# Altium schematic sheet main.SchDoc: OpenSDA
size 431 x 279 mm; Author: Author; CompanyName: Phyzika Technologies, Inc.; Engineer: SanB; Organization: Phyzika Technologies; Address1: 11855 SW Ridgecrest Dr; Address2: Suite 127; Address3: Beaverton, OR 97008; Address4: 503-646-3333; SheetNumber: 1; SheetTotal: 1; SheetSize: 11x17
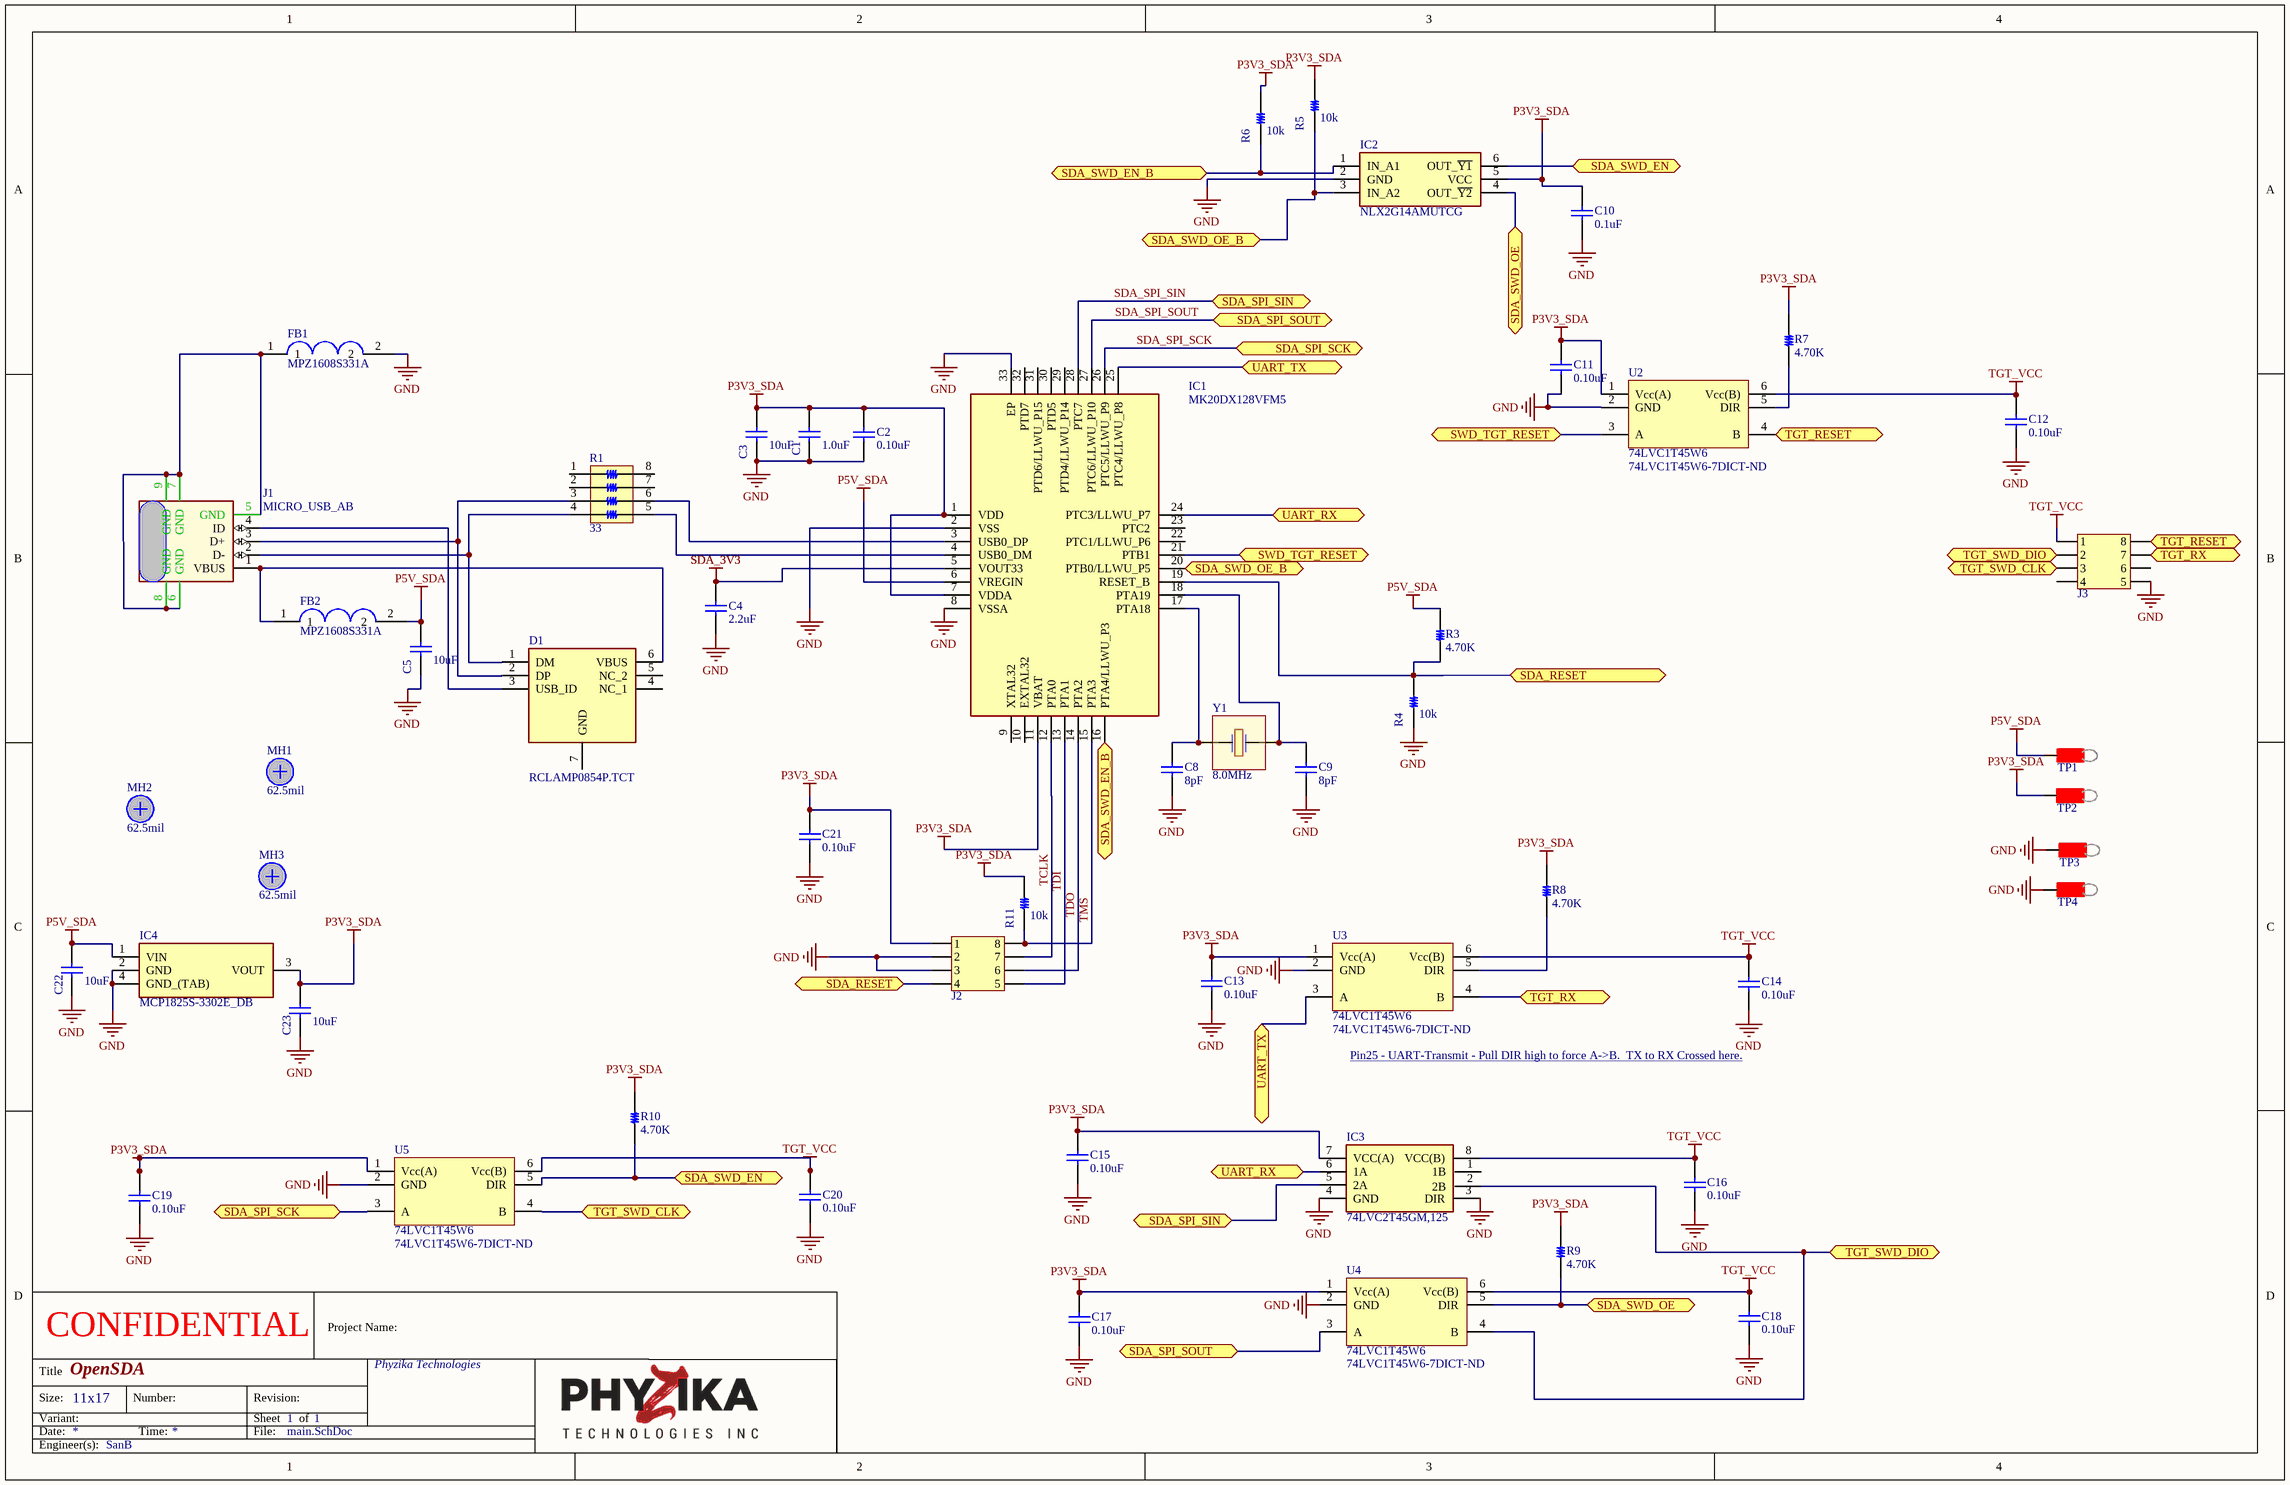
[diagram p0: main.SchDoc]

## Parts
C1  value 1.0uF  [C1005L]  (hidden comment: C105-0402-X5R-16V0-20%)
C2  value 0.10uF  [C1005N]  (hidden comment: C104_0402_X7R_16V0_10%_Kemet)
C3  value 10uF  [C1608N]  (hidden comment: C106-0603-X5R-6.3V_+/-20%_Taiyo Yuden)
C4  2.2uF  [C1005L]
C5  value 10uF  [C1608N]  (hidden comment: C106-0603-X5R-6.3V_+/-20%_Taiyo Yuden)
C8  8pF  [C1005L]
C9  8pF  [C1005L]
C10  value 0.1uF  [C1005L]  (hidden comment: C104_0402_X7R_25V0_10%_Murata)
C11  value 0.10uF  [C1005L]  (hidden comment: C104-0402-X7R-16V0-10%)
C12  value 0.10uF  [C1005L]  (hidden comment: C104-0402-X7R-16V0-10%)
C13  value 0.10uF  [C1005L]  (hidden comment: C104-0402-X7R-16V0-10%)
C14  value 0.10uF  [C1005L]  (hidden comment: C104-0402-X7R-16V0-10%)
C15  value 0.10uF  [C1005L]  (hidden comment: C104-0402-X7R-16V0-10%)
C16  value 0.10uF  [C1005L]  (hidden comment: C104-0402-X7R-16V0-10%)
C17  value 0.10uF  [C1005L]  (hidden comment: C104-0402-X7R-16V0-10%)
C18  value 0.10uF  [C1005L]  (hidden comment: C104-0402-X7R-16V0-10%)
C19  value 0.10uF  [C1005L]  (hidden comment: C104-0402-X7R-16V0-10%)
C20  value 0.10uF  [C1005L]  (hidden comment: C104-0402-X7R-16V0-10%)
C21  value 0.10uF  [C1005N]  (hidden comment: C104_0402_X7R_16V0_10%_Kemet)
C22  value 10uF  [C1608N]  (hidden comment: C106-0603-X5R-6.3V_+/-20%_Taiyo Yuden)
C23  value 10uF  [C1608N]  (hidden comment: C106-0603-X5R-6.3V_+/-20%_Taiyo Yuden)
D1  RCLAMP0854P.TCT  [SON50P160X160X65-7N]
FB1  MPZ1608S331A  [BEADC1608X95N]
FB2  MPZ1608S331A  [BEADC1608X95N]
IC1  MK20DX128VFM5  [QFN50P500X500X100-33N-D]
IC2  NLX2G14AMUTCG  [SON50P100X145X55-6N]
IC3  74LVC2T45GM,125  [74AUP2G08GM125]
IC4  MCP1825S-3302E_DB  [SOT230P700X180-4N]
J1  MICRO_USB_AB  [CONN USB_MIcro_AB]
J2  HEADER 4x2 50mil FCI  [4x2 50mil header_FCI]  (value not drawn)
J3  HEADER 4x2 50mil FCI  [4x2 50mil header_FCI]  (value not drawn)
MH1  62.5mil  [MTHOLE62.5mil]  (no BOM)
MH2  62.5mil  [MTHOLE62.5mil]  (no BOM)
MH3  62.5mil  [MTHOLE62.5mil]  (no BOM)
R1  value 33  [CAC-50P200X100-8N]  (hidden comment: R330_ARRAY_X4_0804_5%_Pan)
R3  value 4.70K  [C1005M]  (hidden comment: R472-0402-1%)
R4  value 10k  [C1005N]  (hidden comment: R103-0402-5%_Yageo)
R5  value 10k  [C1005N]  (hidden comment: R103-0402-5%_Yageo)
R6  value 10k  [C1005N]  (hidden comment: R103-0402-5%_Yageo)
R7  value 4.70K  [C1005M]  (hidden comment: R472-0402-1%)
R8  value 4.70K  [C1005M]  (hidden comment: R472-0402-1%)
R9  value 4.70K  [C1005M]  (hidden comment: R472-0402-1%)
R10  value 4.70K  [C1005M]  (hidden comment: R472-0402-1%)
R11  value 10k  [C1005N]  (hidden comment: R103-0402-5%_Yageo)
TP1  TH_TP_67mil_RED  [TH_TP_67MIL_RED]  (value not drawn)
TP2  TH_TP_67mil_RED  [TH_TP_67MIL_RED]  (value not drawn)
TP3  TH_TP_67mil_RED  [TH_TP_67MIL_RED]  (value not drawn)
TP4  TH_TP_67mil_RED  [TH_TP_67MIL_RED]  (value not drawn)
U2  74LVC1T45W6  Supplier Part Number 1: 74LVC1T45W6-7DICT-ND  [SOT23-6_SOT95P280X145-6N]
U3  74LVC1T45W6  Supplier Part Number 1: 74LVC1T45W6-7DICT-ND  [SOT23-6_SOT95P280X145-6N]
U4  74LVC1T45W6  Supplier Part Number 1: 74LVC1T45W6-7DICT-ND  [SOT23-6_SOT95P280X145-6N]
U5  74LVC1T45W6  Supplier Part Number 1: 74LVC1T45W6-7DICT-ND  [SOT23-6_SOT95P280X145-6N]
Y1  8.0MHz  [XTAL_2-SMD_TXC]

## Ports
SDA_RESET (bidir), SDA_SPI_SCK (bidir), SDA_SPI_SIN (bidir), SDA_SPI_SOUT (bidir), SDA_SWD_EN (bidir), SDA_SWD_EN_B (bidir), SDA_SWD_OE (bidir), SDA_SWD_OE_B (bidir), SWD_TGT_RESET (bidir), TGT_RESET (bidir), TGT_RX (bidir), TGT_SWD_CLK (bidir), TGT_SWD_DIO (bidir), UART_RX (bidir), UART_TX (bidir)

## Nets
GND: C1.1 C2.1 C3.1 C4.1 C5.1 C8.1 C9.1 C10.1 C11.1 C12.1 C13.1 C14.1 C15.1 C16.1 C17.1 C18.1 C19.1 C20.1 C21.1 C22.1 C23.1 FB1.2 IC1.2(VSS) IC1.8(VSSA) IC1.33(EP) IC2.2(GND) IC3.3(DIR) IC3.4(GND) IC4.2(GND) IC4.4(GND_(TAB)) J2.2 J2.3 J3.5 R4.1 TP3.1 TP4.1 U2.2(GND) U3.2(GND) U4.2(GND) U5.2(GND)
P3V3_SDA: C1.2 C2.2 C3.2 C10.2 C11.2 C13.2 C15.2 C17.2 C19.2 C21.2 C23.2 IC1.1(VDD) IC1.7(VDDA) IC1.11(VBAT) IC2.5(VCC) IC3.7(VCC(A)) IC4.3(VOUT) J2.1 R5.2 R6.2 R7.2 R8.2 R9.2 R10.2 R11.2 TP2.1 U2.1(Vcc(A)) U3.1(Vcc(A)) U4.1(Vcc(A)) U5.1(Vcc(A))
P5V_SDA: C5.2 C22.2 FB2.2 IC1.6(VREGIN) IC4.1(VIN) R3.2 TP1.1
TGT_VCC: C12.2 C14.2 C16.2 C18.2 C20.2 IC3.8(VCC(B)) J3.1 U2.6(Vcc(B)) U3.6(Vcc(B)) U4.6(Vcc(B)) U5.6(Vcc(B))
SDA_RESET: IC1.19(RESET_B) J2.4 R3.1 R4.2 ; port SDA_RESET
SDA_SPI_SCK: IC1.26(PTC5/LLWU_P9) U5.3(A) ; port SDA_SPI_SCK
SDA_SPI_SIN: IC1.28(PTC7) IC3.5(2A) ; port SDA_SPI_SIN
SDA_SPI_SOUT: IC1.27(PTC6/LLWU_P10) U4.3(A) ; port SDA_SPI_SOUT
SDA_SWD_EN: IC2.6(OUT_~{Y1}) R10.1 U5.5(DIR) ; port SDA_SWD_EN
SDA_SWD_EN_B: IC1.16(PTA4/LLWU_P3) IC2.1(IN_A1) R6.1 ; port SDA_SWD_EN_B
SDA_SWD_OE: IC2.4(OUT_~{Y2}) R9.1 U4.5(DIR) ; port SDA_SWD_OE
SDA_SWD_OE_B: IC1.20(PTB0/LLWU_P5) IC2.3(IN_A2) R5.1 ; port SDA_SWD_OE_B
SWD_TGT_RESET: IC1.21(PTB1) U2.3(A) ; port SWD_TGT_RESET
TCLK: IC1.12(PTA0) J2.7
TDI: IC1.13(PTA1) J2.5
TDO: IC1.14(PTA2) J2.6
TGT_RESET: J3.8 U2.4(B) ; port TGT_RESET
TGT_RX: J3.7 U3.4(B) ; port TGT_RX
TGT_SWD_CLK: J3.3 U5.4(B) ; port TGT_SWD_CLK
TGT_SWD_DIO: IC3.2(2B) J3.2 U4.4(B) ; port TGT_SWD_DIO
TMS: IC1.15(PTA3) J2.8 R11.1
UART_RX: IC1.24(PTC3/LLWU_P7) IC3.6(1A) ; port UART_RX
UART_TX: IC1.25(PTC4/LLWU_P8) U3.3(A) ; port UART_TX
NetC4_2: C4.2 IC1.5(VOUT33)
NetC8_2: C8.2 IC1.17(PTA18) Y1.1(OSC1)
NetC9_2: C9.2 IC1.18(PTA19) Y1.2(OSC2)
NetD1_1: D1.1(DM) J1.2(D-) R1.4
NetD1_2: D1.2(DP) J1.3(D+) R1.3
NetD1_3: D1.3(USB_ID) J1.4(ID)
NetD1_6: D1.6(VBUS) FB2.1 J1.1(VBUS)
NetFB1_1: FB1.1 J1.5(GND) J1.6(GND) J1.7(GND) J1.8(GND) J1.9(GND)
NetIC1_3: IC1.3(USB0_DP) R1.6
NetIC1_4: IC1.4(USB0_DM) R1.5
NetR7_1: R7.1 U2.5(DIR)
NetR8_1: R8.1 U3.5(DIR)

Not connected (* = marked no-connect by the designer): D1 4(NC_1) 5(NC_2) 7(GND); IC1 9(XTAL32) 10(EXTAL32) 22(PTC1/LLWU_P6) 23(PTC2) 29(PTD4/LLWU_P14) 30(PTD5) 31(PTD6/LLWU_P15) 32(PTD7); IC3 1(1B); J3 4 6; R1 1 2 7 8

## Notes on the sheet
- Pin25 - UART-Transmit - Pull DIR high to force A->B.  TX to RX Crossed here. <https://www.mouser.com/Search/Refine?Keyword=MKE04Z128VLD4>
- Title
- CONFIDENTIAL
- Project Name:
- Size:
- Date:
- Variant:
- Number:
- Time:
- File:
- Revision:
- Sheet
- of
- Engineer(s):

## Library data of the parts
C1 = C105-0402-X5R-16V0-20%: 1.0uF, 0402, 16V0, 20%, X5R; Manufacturer 1: Taiyo Yuden; Manufacturer Part Number 1: TMK105BJ105MV-F; Supplier 1: Digi-Key; Supplier Part Number 1: 587-3245-1-ND
C2 C21 = C104_0402_X7R_16V0_10%_Kemet: CAP CER 0.1UF 16V 10% X7R 0402; Manufacturer 1: Kemet; Manufacturer Part Number 1: C0402C104K4RACTU; Supplier 1: Digi-Key; Supplier Part Number 1: 399-3521-1-ND
C3 C5 C22 C23 = C106-0603-X5R-6.3V_+/-20%_Taiyo Yuden: CAP CER 10UF 6.3V X5R 0603; Manufacturer Part Number 1: JMK107ABJ106MA-T; Supplier 1: Digi-Key; Supplier Part Number 1: 587-5869-1-ND; Manufacturer 1: Taiyo Yuden
C4 = CC0402MRX5R6BB225: CAP CER 2.2UF 10V X5R 0402; Manufacturer: Yageo; Tolerance: 20%; Supplier 1: Digi-Key; Manufacturer Part Number: CC0402MRX5R6BB225; RoHS: Yes; Category: Ceramic Capacitors; Stock 1: 48880; Pricing 1: 1=0.11000, 10=0.07800, 50=0.04260, 100=0.03470, 500=0.02480, 1000=0.01948, 2500=0.01771, 5000=0.01629 (USD); Mount: Surface Mount; Case/Package: 0402; Weight: 2.3E-05oz; Case Code (Metric): 1005; Case Code (Imperial): 0402; Min Operating Temperature: -55°C; Max Operating Temperature: 85°C; Packaging: Tape and Reel; Capacitance: 2.2uF; Voltage Rating: 10V; Dielectric: X5R; Termination: SMD/SMT; Voltage Rating (DC): 10V; Package Quantity: 5000; Length: 0.039inch; Width: 0.02inch; Thickness: 0.022inch; Lead Free: Lead Free; Halogen Free: Halogen Free; ComponentLink1URL: http://www.mouser.com/ds/2/447/Yageo_UPY-GP_NP0_16V-to-50V_9-358835.pdf?src-supplier=Mouser; ComponentLink1Description: http://www.mouser.com/ds/2/447/Yageo_UPY-GP_NP0_16V-to-50V_9-358835.pdf?src-supplier=Mouser; ComponentLink2URL: http://www.yageo.com/exep/pages/download/literatures/ProductSelectionGuide%202014_Final_2.pdf?src-supplier=Digi-Key; ComponentLink2Description: http://www.yageo.com/exep/pages/download/literatures/ProductSelectionGuide%202014_Final_2.pdf?src-supplier=Digi-Key; ComponentLink3URL: http://www.yageo.com/documents/recent/UPY-GPHC_X5R_4V-to-50V_25.pdf?src-supplier=Digi-Key; ComponentLink3Description: http://www.yageo.com/documents/recent/UPY-GPHC_X5R_4V-to-50V_25.pdf?src-supplier=Digi-Key; Supplier Part Number 1: 311-1733-1-ND
C8 C9 = CC0402DRNPO9BN8R0: CAPACITOR CERAMIC 8PF 50V, C0G/NP0, 0.5pF, 0402; Manufacturer: Yageo; Insulation Resistance: 10GR; Dielectric: C0G; Supplier 1: Digi-Key; Manufacturer Part Number: CC0402DRNPO9BN8R0; RoHS: Yes; Category: Ceramic Capacitors; Stock 1: 97356; Pricing 1: 1=0.10000, 10=0.03200, 100=0.01410, 500=0.01004, 1000=0.00790, 2500=0.00718, 5000=0.00660 (USD); Mount: Surface Mount; Case/Package: 0402; Number of Pins: 2; Case Code (Imperial): 0402; Case Code (Metric): 1005; Min Operating Temperature: -55°C; Max Operating Temperature: 125°C; Termination: SMD/SMT; Composition: Ceramic; Voltage Rating: 50V; Capacitance: 8pF; Voltage Rating (DC): 50V; Packaging: Tape and Reel; Length: 1mm; Thickness: 0.022inch; Depth: 0.5mm; Width: 0.02inch; Lead Free: Lead Free; ComponentLink1URL: https://datasheet.ciiva.com/13211/upy-gp-np0-16v-to-50v-8-13211222.pdf?src-supplier=Mouser; ComponentLink1Description: https://datasheet.ciiva.com/13211/upy-gp-np0-16v-to-50v-8-13211222.pdf?src-supplier=Mouser; Supplier 2: Mouser; Stock 2: 49855; Pricing 2: 1=0.10000, 10=0.02000, 100=0.00900, 1000=0.00700, 2500=0.00500, 10000=0.00500 (USD); Supplier Part Number 1: 311-1639-1-ND; Supplier Part Number 2: 603-CC402DRNPO9BN8R0
C10 = C104_0402_X7R_25V0_10%_Murata: CAP CER 0.1UF 10V 10% X7R 0402; Manufacturer 1: Murata Electronics North America; Manufacturer Part Number 1: GRM155R71A104KA01D; Supplier 1: Digi-Key; Supplier Part Number 1: 490-6321-1-ND; Supplier 2: Digi-Key; Supplier Part Number 2: 490-6321-2-ND
C11-C20 = C104-0402-X7R-16V0-10%: CAP CER 0.1UF 16V X7R 0402; Manufacturer: Samsung; Manufacturer Part Number 1: CL05B104KO5NNNC; Tolerance: 10%; Temperature Stability: +/-15%; Material: Ceramic; Capacitance: 100nF; Size: 0402; Voltage: 16V; Supplier 1: Digi-Key; Supplier Part Number 1: 1276-1001-1-ND; RoHS: Yes; Category: Ceramic Capacitors; Stock 1: 24330664; Pricing 1: 1=0.10000, 10=0.02900, 100=0.01290, 500=0.00924, 1000=0.00726, 2500=0.00660, 5000=0.00607 (USD); Mount: Surface Mount; Case/Package: 0402; Case Code (Imperial): 0402; Case Code (Metric): 1005; Contact Plating: Tin; Min Operating Temperature: -55°C; Max Operating Temperature: 125°C; Dielectric: X7R; Voltage Rating (DC): 16V; Package Quantity: 1; Packaging: Tape and Reel; Voltage Rating: 16V; Length: 1mm; Height: 0.5mm; Thickness: 0.022inch; Depth: 0.5mm; Width: 0.02inch; Radiation Hardening: No; Lead Free: Lead Free; ComponentLink1URL: https://datasheet.ciiva.com/26920/getdatasheetpartid-359683-26920169.pdf?src-supplier=Verical; ComponentLink1Description: https://datasheet.ciiva.com/26920/getdatasheetpartid-359683-26920169.pdf?src-supplier=Verical; ComponentLink2URL: https://datasheet.ciiva.com/29198/458718-da-01-en-vs-kondensator-0402-29198423.pdf?src-supplier=Conrad; ComponentLink2Description: https://datasheet.ciiva.com/29198/458718-da-01-en-vs-kondensator-0402-29198423.pdf?src-supplier=Conrad; ComponentLink3URL: https://datasheet.ciiva.com/16208/cl05b104kq5nnnc-16208343.pdf?src-supplier=Future+Electronics; ComponentLink3Description: https://datasheet.ciiva.com/16208/cl05b104kq5nnnc-16208343.pdf?src-supplier=Future+Electronics; ComponentLink4URL: https://datasheet.ciiva.com/26309/mlcc-catalogdownload2013-eng-26309003.pdf?src-supplier=Distrelec; ComponentLink4Description: https://datasheet.ciiva.com/26309/mlcc-catalogdownload2013-eng-26309003.pdf?src-supplier=Distrelec; Supplier 2: Future Electronics; Stock 2: 30484639; Pricing 2: 1=0.00960, 500=0.00700, 1500=0.00660, 2500=0.00640, 5000=0.00620 (USD); Supplier Part Number 2: CL05B104KO5NNNC-CUTT
D1 = RCLAMP0854P.TCT: TVS Diode (Bi-directional); Manufacturer_Name: SEMTECH; Datasheet Link: https://www.semtech.com/uploads/documents/rclamp0854p.pdf; Height: 0.65mm; Manufacturer_Part_Number: RCLAMP0854P.TCT; Arrow Part Number: RCLAMP0854P.TCT; Arrow Price/Stock: https://www.arrow.com/en/products/rclamp0854p.tct/semtech; Mouser Part Number: 947-RCLAMP0854P.TCT; Mouser Price/Stock: https://www.mouser.co.uk/ProductDetail/Semtech/RCLAMP0854PTCT?qs=rBWM4%252BvDhIclAOYs1MksDA%3D%3D
FB1 FB2 = MPZ1608S331A: Ferrite Bead; Manufacturer_Name: TDK; Datasheet Link: https://www.mouser.com/datasheet/2/400/eads_commercial_power_mpz1608_en-923650.pdf; Height: 0.95mm; Manufacturer_Part_Number: MPZ1608S331A; Arrow Part Number: MPZ1608S331A; Arrow Price/Stock: https://www.arrow.com/en/products/mpz1608s331a/tdk; Mouser Part Number: 810-MPZ1608S331A; Mouser Price/Stock: https://www.mouser.co.uk/ProductDetail/TDK/MPZ1608S331A?qs=0D2o47UmnR9mzpsecXlyzQ%3D%3D
IC1 = MK20DX128VFM5: NXP - MK20DX128VFM5 - MCU, 32BIT, CORTEX-M4, 50MHZ, QFN-32; Manufacturer: NXP Freescale; Oscillator Type: Internal; Number of Programmable I/O: 20; Data Bus Width: 32b; Number of USB Channels: 1; Memory Type: FLASH; Memory Size: 128KB; Number of UART Channels: 2; Min Supply Voltage: 1.71V; Max Supply Voltage: 3.6V; RAM Size: 16KB; Interface: I2C,SPI,USB,IrDA,UART,USART,CAN,I2S; Number of Timers/Counters: 14; Core Architecture: ARM; Peripherals: POR,PWM,WDT,DMA,LVD,I2C; Datasheet Link: http://www.nxp.com/docs/en/data-sheet/K20P32M50SF0.pdf; Height: 1mm; Manufacturer Name: NXP; Manufacturer Part Number 1: MK20DX128VFM5; Arrow Part Number: MK20DX128VFM5; Arrow Price/Stock: https://www.arrow.com/en/products/mk20dx128vfm5/nxp-semiconductors; Mouser Part Number: 841-MK20DX128VFM5; Mouser Price/Stock: https://www.mouser.co.uk/ProductDetail/NXP-Semiconductors/MK20DX128VFM5?qs=b%252B6ZnhyoAL%252B%2FGUAqk82Hrg%3D%3D; Supplier 1: Digi-Key; Manufacturer Part Number: MK20DX128VFM5; RoHS: Yes; Category: Microcontrollers; Stock 1: 7204; Pricing 1: 1=6.14000, 10=5.51700, 25=5.21560, 100=4.52010, 250=4.28832, 500=3.84788, 1000=3.24520, 2500=3.08294, 5000=2.96704 (USD); Mount: Surface Mount; Case/Package: QFN; Number of Pins: 32; Weight: 0.002198oz; Min Operating Temperature: -40°C; Max Operating Temperature: 105°C; Max Frequency: 50MHz; Number of ADC Channels: 1; Number of SPI Channels: 1; Number of I2C Channels: 1; Package Quantity: 490; Packaging: Tray; Frequency: 50MHz; Number of I/Os: 20; Length: 5mm; Width: 5mm; Radiation Hardening: No; REACH SVHC: No SVHC; Lead Free: Lead Free; Halogen Free: Halogen Free; ComponentLink1URL: https://datasheet.ciiva.com/6654/k20p32m50sf0-6654512.pdf?src-supplier=Digi-Key; ComponentLink1Description: https://datasheet.ciiva.com/6654/k20p32m50sf0-6654512.pdf?src-supplier=Digi-Key; ComponentLink2URL: https://datasheet.ciiva.com/41452/001183410-da-01-en-ic-arm-cortex-m-mk20dx128vfm5-qfn-32-fre-41452897.pdf?src-supplier=Conrad; ComponentLink2Description: https://datasheet.ciiva.com/41452/001183410-da-01-en-ic-arm-cortex-m-mk20dx128vfm5-qfn-32-fre-41452897.pdf?src-supplier=Conrad; ComponentLink3URL: https://datasheet.ciiva.com/9232/k20p32m50sf0-9232714.pdf?src-supplier=Avnet; ComponentLink3Description: https://datasheet.ciiva.com/9232/k20p32m50sf0-9232714.pdf?src-supplier=Avnet; ComponentLink4URL: https://datasheet.ciiva.com/16366/mk20dx128vfm5-16366586.pdf?src-supplier=Future+Electronics; ComponentLink4Description: https://datasheet.ciiva.com/16366/mk20dx128vfm5-16366586.pdf?src-supplier=Future+Electronics; ComponentLink5URL: https://datasheet.ciiva.com/7780/1605598-7780206.pdf?src-supplier=Element14; ComponentLink5Description: https://datasheet.ciiva.com/7780/1605598-7780206.pdf?src-supplier=Element14; Supplier Part Number 1: MK20DX128VFM5-ND
IC2 = NLX2G14AMUTCG: Integrated Circuit; Manufacturer_Name: ON Semiconductor; Datasheet Link: http://www.onsemi.com/pub/Collateral/NLX2G14-D.PDF; Height: 0.55mm; Manufacturer_Part_Number: NLX2G14AMUTCG; Arrow Part Number: NLX2G14AMUTCG; Arrow Price/Stock: https://www.arrow.com/en/products/nlx2g14amutcg/on-semiconductor; Mouser Part Number: 863-NLX2G14AMUTCG; Mouser Price/Stock: https://www.mouser.co.uk/ProductDetail/ON-Semiconductor/NLX2G14AMUTCG?qs=k6dkFvHqcvDOIgYtx3wHeg%3D%3D
IC3 = 74LVC2T45GM,125: Integrated Circuit; Manufacturer_Name: Nexperia; Datasheet Link: https://assets.nexperia.com/documents/data-sheet/74LVC_LVCH2T45.pdf; Height: 0.5mm; Manufacturer_Part_Number: 74LVC2T45GM,125; Arrow Part Number: 74LVC2T45GM,125; Arrow Price/Stock: https://www.arrow.com/en/products/74lvc2t45gm125/nexperia; Mouser Part Number: 771-74LVC2T45GM125; Mouser Price/Stock: https://www.mouser.co.uk/ProductDetail/Nexperia/74LVC2T45GM125?qs=jquClx72t9D6MUd%252BURVS1Q%3D%3D
IC4 = MCP1825S-3302E_DB: Integrated Circuit; Manufacturer_Name: Microchip; Manufacturer Part Number 1: MCP1825S-3302E/DB; Allied_Number: 70046538; Datasheet Link: http://docs-emea.rs-online.com/webdocs/137e/0900766b8137ed40.pdf; Height: 1.8mm; Mouser Part Number: 579-MCP1825S-3302EDB; Mouser Price/Stock: https://www.mouser.co.uk/ProductDetail/Microchip-Technology/MCP1825S-3302E-DB?qs=gsqZ4L1luKoZerS%252BYohoGg%3D%3D; RS Part Number: 6695092P; RS Price/Stock: http://uk.rs-online.com/web/p/products/6695092P; Allied Price/Stock: http://www.alliedelec.com/microchip-technology-inc-mcp1825s-3302e-db/70046538/
J1 = CONN_MICRO_USB_AB_10104111-0001LF_FCI: USB - micro AB USB 2.0 Receptacle Connector 5 Position Surface Mount, Right Angle, Horizontal; Manufacturer 1: Amphenol FCI; Supplier 1: Digikey; Supplier Part Number 1: 609-4053-1-ND; Manufacturer Part Number 1: 10104111-0001LF; VALUE: MICRO_USB_AB
J2 J3 = HEADER 4x2 50mil FCI: CONN HEADER 8POS DL UNSHRD SMD; Manufacturer Part Number 1: 20021121-00008C4LF; Supplier 1: Digi-key; Supplier Part Number 1: 609-3694-1-ND; Manufacturer 1: FCI
MH1-MH3 = MTHOLE62.5mil: Part Number: NOT A PART; PART DESC: Mounting Hole, 1/16", non-plated; Value: Mounting Hole; PCB DECAL: MTHOLE125
R1 = R330_ARRAY_X4_0804_5%_Pan: RES ARRAY 4 RES 33 OHM 0804; Manufacturer 1: Panasonic Electronic Components; Manufacturer Part Number 1: EXB-N8V330JX; Supplier 1: Digi-Key; Supplier Part Number 1: Y10330CT-ND
R3 R7-R10 = R472-0402-1%: RES 4.7K OHM 1/10W 1% 0402 SMD; Power Rating: 100mW; Temperature Coefficient: +-100ppm/C; Tolerance: 1%; Supplier 1: Digi-Key; Supplier Part Number 1: P4.70KLCT-ND; Package/Size: 0402
R4-R6 R11 = R103-0402-5%_Yageo: RES SMD 10K OHM 5% 1/16W 0402; Manufacturer Part Number 1: RC0402JR-0710KL; Manufacturer 1: Yageo; Supplier 1: Digi-key; Supplier Part Number 1: 311-10KJRCT-ND
TP1-TP4 = TH_TP_67mil_RED: TEST POINT PC MULTI PURPOSE RED; Munfacturer Part Number 1: 36-5010-ND; Manuafcturer 1: Keystone Electronics; Supplier 1: Digi-Key; Supplier Part Number 1: 36-5010-ND
U2-U5 = 74LVC1T45W6-7: 74LVC Series 5.5 V 3-State SMT Single Bit Dual Supply Transceiver - SOT-26; Manufacturer: Diodes; Max Supply Voltage: 5.5V; Min Supply Voltage: 1.65V; Channel Type: Bidirectional; Number of Circuits: 1; Operating Supply Current: 4uA; Logic Function: Translator; Low Level Output Current: 32mA; High Level Output Current: -32mA; Quiescent Current: 3uA; Supplier 1: Digi-Key; Manufacturer Part Number: 74LVC1T45W6-7; RoHS: Yes; Category: Voltage Level Shifters; Stock 1: 23489; Pricing 1: 1=0.36000, 10=0.27200, 25=0.23760, 100=0.15370, 250=0.12728, 500=0.10182, 1000=0.07806 (USD); Mount: Surface Mount; Case/Package: SOT-23-6; Contact Plating: Tin,Matte; Min Operating Temperature: -40°C; Max Operating Temperature: 125°C; Package Quantity: 3000; Packaging: Tape and Reel; Number of Channels: 1; ComponentLink1URL: http://www.mouser.com/ds/2/115/74LVC1T45-318124.pdf?src-supplier=Mouser; ComponentLink1Description: http://www.mouser.com/ds/2/115/74LVC1T45-318124.pdf?src-supplier=Mouser; ComponentLink2URL: http://www.diodes.com/datasheets/74LVC1T45.pdf?src-supplier=Avnet; ComponentLink2Description: http://www.diodes.com/datasheets/74LVC1T45.pdf?src-supplier=Avnet; ComponentLink3URL: https://www.diodes.com/assets/Datasheets/74LVC1T45.pdf?src-supplier=Digi-Key; ComponentLink3Description: https://www.diodes.com/assets/Datasheets/74LVC1T45.pdf?src-supplier=Digi-Key
Y1 = CRYSTAL_8MHZ_2-SMD_AA-8.000MALV-T_TXC: 8MHz ±30ppm Crystal 8pF 150 Ohm -40°C ~ 125°C AEC-Q200 Surface Mount 2-SMD; Manufacturer 1: TXC CORPORATION; Manufacturer Part Number 1: AA-8.000MALV-T; Supplier 1: Digi-Key; Supplier Part Number 1: 887-1667-1-ND; Value: 8.0MHz